# EAGLE design GasSensorCentral_v1.3 (EAGLE 7.2.0)
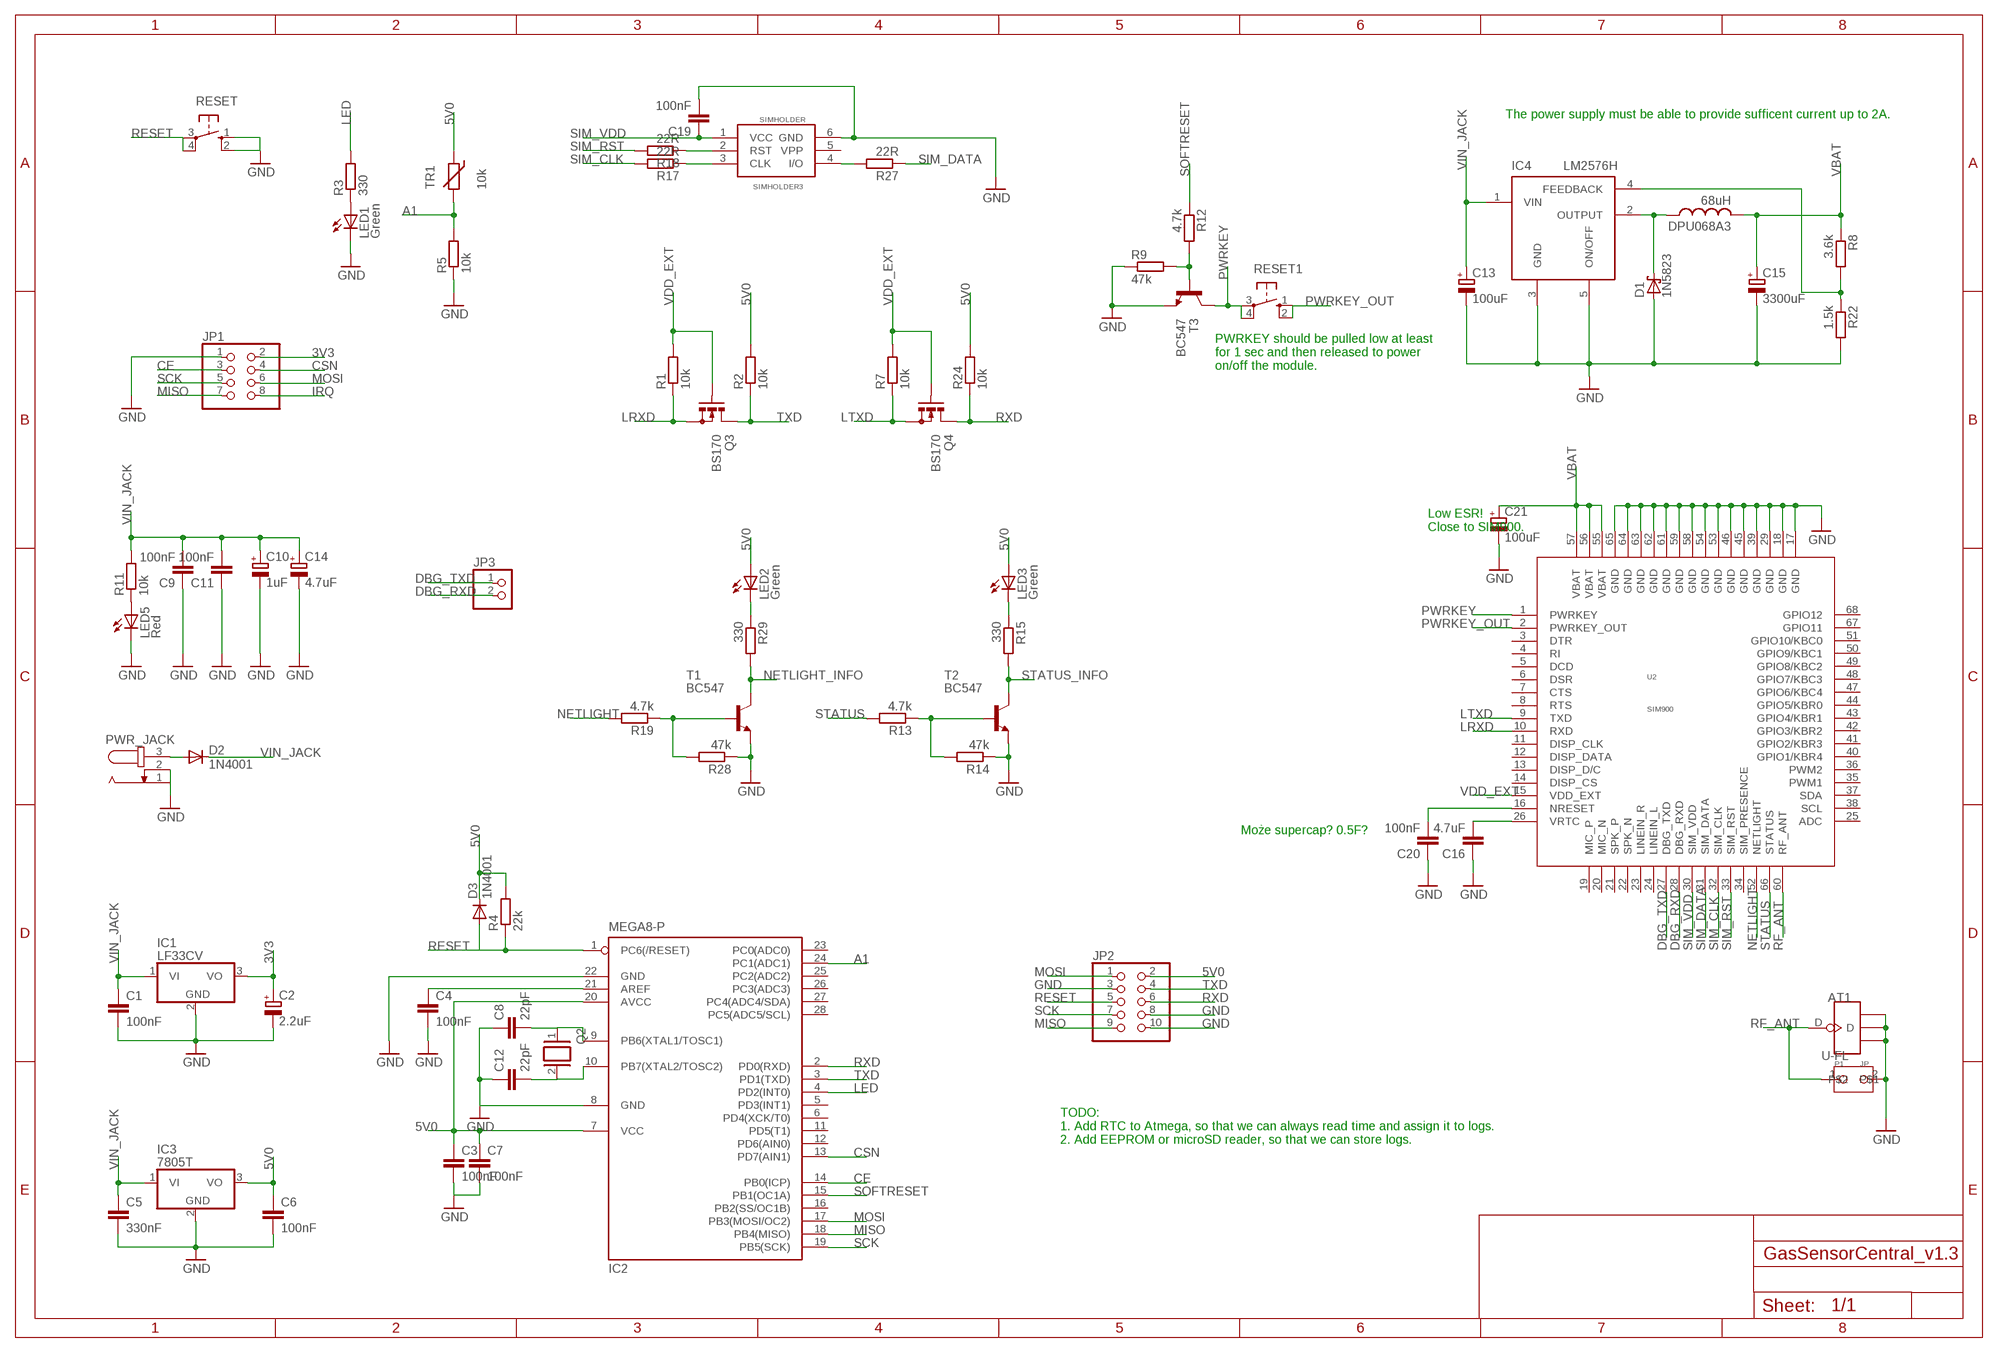
[diagram p0: schematic, sheet 1]

## Parts
AT1  U-FL  ANTENNA-U-FL  [4P-U-FL]
C1  100nF  C-EU025-025X050  [C025-025X050]
C2  2.2uF  CPOL-EUE2.5-5  [E2,5-5]
C3  100nF  C-EU025-025X050  [C025-025X050]
C4  100nF  C-EU025-025X050  [C025-025X050]
C5  330nF  C-EU025-025X050  [C025-025X050]
C6  100nF  C-EU025-025X050  [C025-025X050]
C7  100nF  C-EU025-025X050  [C025-025X050]
C8  22pF  C-EU025-025X050  [C025-025X050]
C9  100nF  C-EU025-025X050  [C025-025X050]
C10  1uF  CPOL-EUE2.5-5  [E2,5-5]
C11  100nF  C-EU025-025X050  [C025-025X050]
C12  22pF  C-EU025-025X050  [C025-025X050]
C13  100uF  CPOL-EUE2.5-5  [E2,5-5]
C14  4.7uF  CPOL-EUE2.5-5  [E2,5-5]
C15  3300uF  CPOL-EUE3.5-10  [E3,5-10]
C16  4.7uF  C-EU025-025X050  [C025-025X050]
C19  100nF  C-EU025-025X050  [C025-025X050]
C20  100nF  C-EU025-025X050  [C025-025X050]
C21  100uF  CPOL-EUE2.5-5  [E2,5-5]
D1  1N5823  1N5817-B  [DO41-7.6]
D2  1N4001  1N4004  [DO41-10]
D3  1N4001  1N4004  [DO41-10]
DPU068A3  68uH  L-USTJ3-U1  [TJ3-U1]
IC1  LF33CV  7805T  [TO220H]
IC2  MEGA8-P  [DIL28-3]
IC3  7805T  [TO220H]
IC4  LM2576H  [TO220-52]
JP1  PINHD-2X4  [2X04]
JP2  PINHD-2X5  [2X05]
JP3  PINHD-1X2  [1X02]
LED1  Green  LED3MM  [LED3MM]
LED2  Green  LED3MM  [LED3MM]
LED3  Green  LED3MM  [LED3MM]
LED5  Red  LED3MM  [LED3MM]
P1  JP  [JP]
PWR_JACK  JACK-PLUG0  [SPC4077]
Q2  XTAL/S  [QS]
Q3  BS170  [SOT54E]
Q4  BS170  [SOT54E]
R1  10k  R-EU_0207/10  [0207/10]
R2  10k  R-EU_0207/10  [0207/10]
R3  330  R-EU_0207/10  [0207/10]
R4  22k  R-EU_0207/10  [0207/10]
R5  10k  R-EU_0207/10  [0207/10]
R7  10k  R-EU_0207/10  [0207/10]
R8  3.6k  R-EU_0207/10  [0207/10]
R9  47k  R-EU_0207/10  [0207/10]
R11  10k  R-EU_0207/10  [0207/10]
R12  4.7k  R-EU_0207/10  [0207/10]
R13  4.7k  R-EU_0207/10  [0207/10]
R14  47k  R-EU_0207/10  [0207/10]
R15  330  R-EU_0207/10  [0207/10]
R17  22R  R-EU_0207/10  [0207/10]
R18  22R  R-EU_0207/10  [0207/10]
R19  4.7k  R-EU_0207/10  [0207/10]
R22  1.5k  R-EU_0207/10  [0207/10]
R24  10k  R-EU_0207/10  [0207/10]
R27  22R  R-EU_0207/10  [0207/10]
R28  47k  R-EU_0207/10  [0207/10]
R29  330  R-EU_0207/10  [0207/10]
RESET  10-XX  [B3F-10XX]
RESET1  10-XX  [B3F-10XX]
SIMHOLDER  SIMHOLDER3  [SIMHOLDER3]
T1  BC547  [TO92]
T2  BC547  [TO92]
T3  BC547  [TO92]
TR1  10k  THERMISTOR_R-2,5  [RS-2,5]
U2  SIM900  [SIM900]

## Nets
3V3: C2.+ IC1.3(VO) JP1.2
5V0: C3.1 C6.1 C7.1 D3.C IC2.7(VCC) IC2.20(AVCC) IC3.3(VO) JP2.2 LED2.A LED3.A R2.2 R4.2 R24.2 TR1.1
A1: IC2.24(PC1(ADC1)) R5.2 TR1.2
CE: IC2.14(PB0(ICP)) JP1.3
CSN: IC2.13(PD7(AIN1)) JP1.4
DBG_RXD: JP3.2 U2.28(DBG_RXD)
DBG_TXD: JP3.1 U2.27(DBG_TXD)
GND: AT1.GND1 AT1.GND2 AT1.GND3 C1.2 C2.- C3.2 C4.2 C5.2 C6.2 C7.2 C8.1 C9.1 C10.- C11.1 C12.1 C13.- C14.- C15.- C16.1 C19.2 C20.1 C21.- D1.A IC1.2(GND) IC2.8(GND) IC2.22(GND) IC3.2(GND) IC4.3(GND) IC4.5(ON/OFF) JP1.1 JP2.3 JP2.8 JP2.10 LED1.K(C) LED5.K(C) P1.2 PWR_JACK.1 PWR_JACK.2 R5.1 R9.1 R14.1 R22.2 R28.1 RESET.1(S) RESET.2(S1) SIMHOLDER.6(GND) T1.1(E) T2.1(E) T3.1(E) U2.17(GND) U2.18(GND) U2.29(GND) U2.39(GND) U2.45(GND) U2.46(GND) U2.53(GND) U2.54(GND) U2.58(GND) U2.59(GND) U2.61(GND) U2.62(GND) U2.63(GND) U2.64(GND) U2.65(GND)
IRQ: JP1.8
LED: IC2.4(PD2(INT0)) R3.2
LRXD: Q3.S R1.1 U2.10(RXD)
LTXD: Q4.S R7.1 U2.9(TXD)
MISO: IC2.18(PB4(MISO)) JP1.7 JP2.9
MOSI: IC2.17(PB3(MOSI/OC2)) JP1.6 JP2.1
N$1: C4.1 IC2.21(AREF)
N$3: IC4.4(FEEDBACK) R8.2 R22.1
N$4: D2.A PWR_JACK.3
N$5: LED1.A R3.1
N$6: R27.2 SIMHOLDER.4(I/O)
N$7: LED2.K(C) R29.1
N$9: R13.1 R14.2 T2.2(B)
N$10: LED5.A R11.1
N$11: LED3.K(C) R15.1
N$12: D1.C DPU068A3.1 IC4.2(OUTPUT)
N$13: C20.2 U2.16(NRESET)
N$14: R9.2 R12.2 T3.2(B)
N$15: R19.1 R28.2 T1.2(B)
N$17: C16.2 U2.26(VRTC)
N$24: R18.1 SIMHOLDER.2(RST)
N$25: R17.1 SIMHOLDER.3(CLK)
N$29: C8.2 IC2.9(PB6(XTAL1/TOSC1)) Q2.1
N$35: C12.2 IC2.10(PB7(XTAL2/TOSC2)) Q2.2
NETLIGHT: R19.2 U2.52(NETLIGHT)
NETLIGHT_INFO: R29.2 T1.3(C)
PWRKEY: RESET1.3(P) RESET1.4(P1) T3.3(C) U2.1(PWRKEY)
PWRKEY_OUT: RESET1.1(S) RESET1.2(S1) U2.2(PWRKEY_OUT)
RESET: D3.A IC2.1(PC6(/RESET)) JP2.5 R4.1 RESET.3(P) RESET.4(P1)
RF_ANT: AT1.D P1.1 U2.60(RF_ANT)
RXD: IC2.2(PD0(RXD)) JP2.6 Q4.D R24.1
SCK: IC2.19(PB5(SCK)) JP1.5 JP2.7
SIM_CLK: R17.2 U2.32(SIM_CLK)
SIM_DATA: R27.1 U2.31(SIM_DATA)
SIM_RST: R18.2 U2.33(SIM_RST)
SIM_VDD: C19.1 SIMHOLDER.1(VCC) U2.30(SIM_VDD)
SOFTRESET: IC2.15(PB1(OC1A)) R12.1
STATUS: R13.2 U2.66(STATUS)
STATUS_INFO: R15.2 T2.3(C)
TXD: IC2.3(PD1(TXD)) JP2.4 Q3.D R2.1
VBAT: C15.+ C21.+ DPU068A3.2 R8.1 U2.55(VBAT) U2.56(VBAT) U2.57(VBAT)
VDD_EXT: Q3.G Q4.G R1.2 R7.2 U2.15(VDD_EXT)
VIN_JACK: C1.1 C5.1 C9.2 C10.+ C11.2 C13.+ C14.+ D2.C IC1.1(VI) IC3.1(VI) IC4.1(VIN) R11.2
Unconnected: IC2.5(PD3(INT1)) IC2.6(PD4(XCK/T0)) IC2.11(PD5(T1)) IC2.12(PD6(AIN0)) IC2.16(PB2(SS/OC1B)) IC2.23(PC0(ADC0)) IC2.25(PC2(ADC2)) IC2.26(PC3(ADC3)) IC2.27(PC4(ADC4/SDA)) IC2.28(PC5(ADC5/SCL)) SIMHOLDER.5(VPP) U2.3(DTR) U2.4(RI) U2.5(DCD) U2.6(DSR) U2.7(CTS) U2.8(RTS) U2.11(DISP_CLK) U2.12(DISP_DATA) U2.13(DISP_D/C) U2.14(DISP_CS) U2.19(MIC_P) U2.20(MIC_N) U2.21(SPK_P) U2.22(SPK_N) U2.23(LINEIN_R) U2.24(LINEIN_L) U2.25(ADC) U2.34(SIM_PRESENCE) U2.35(PWM1) U2.36(PWM2) U2.37(SDA) U2.38(SCL) U2.40(GPIO1/KBR4) U2.41(GPIO2/KBR3) U2.42(GPIO3/KBR2) U2.43(GPIO4/KBR1) U2.44(GPIO5/KBR0) U2.47(GPIO6/KBC4) U2.48(GPIO7/KBC3) U2.49(GPIO8/KBC2) U2.50(GPIO9/KBC1) U2.51(GPIO10/KBC0) U2.67(GPIO11) U2.68(GPIO12)

## Notes on the sheet
- The power supply must be able to provide sufficent current up to 2A.
- PWRKEY should be pulled low at least 
  for 1 sec and then released to power 
  on/off the module.
- Low ESR!
  Close to SIM900.
- Może supercap? 0.5F?
- TODO:
  1. Add RTC to Atmega, so that we can always read time and assign it to logs.
  2. Add EEPROM or microSD reader, so that we can store logs.

## Library data of the parts
AT1 = Connector:ANTENNA-U-FL
C1 C3-C9 C11 C12 C16 C19 C20 = rcl:C-EU: CAPACITOR, European symbol
C2 C10 C13-C15 C21 = rcl:CPOL-EU: POLARIZED CAPACITOR, European symbol
D1 = diode:1N581*: 1.0A SCHOTTKY BARRIER RECTIFIER Source: http://www.diodes.com/datasheets/ds23001.pdf
D2 D3 = diode:1N4004: DIODE general purpose rectifier, 1 A
DPU068A3 = rcl:L-US: INDUCTOR, American symbol
IC1 IC3 = linear:78*: Positive VOLTAGE REGULATOR Source: http://cache.national.com/ds/LM/LM78L05.pdf http://www.fairchildsemi.com/ds/LM/LM7805.pdf
IC2 = atmel:MEGA8-P: MICROCONTROLLER 8 Kbytes FLASH, 1 kbytes SRAM, 512 bytes EEPROM, USART, 4-channel 10 bit ADC, 2-channel 8 bit ADC Pin compatible with Atmega48, ATMega88, ATMega168 Source: avr.lbr; OC_FARNELL: unknown; OC_NEWARK: unknown
IC4 = hosho:LM2576H
JP1 = pinhead:PINHD-2X4: PIN HEADER
JP2 = pinhead:PINHD-2X5: PIN HEADER
JP3 = pinhead:PINHD-1X2: PIN HEADER
LED1-LED3 LED5 = led:LED: LED OSRAM: - CHIPLED LG R971, LG N971, LY N971, LG Q971, LY Q971, LO R971, LY R971 LH N974, LH R974 LS Q976, LO Q976, LY Q976 LO Q996 - Hyper CHIPLED LW Q18S LB Q993, LB Q99A, LB R99A - SideLED LS A670, LO A670, LY A670, LG A670, LP A670 LB A673, LV A673, LT A673, LW A673 LH A674 LY A675 LS A676, LA A676, LO A676, LY A676, LW A676 LS A679, LY A679, LG A679 - Hyper Micro SIDELED® LS Y876, LA Y876, LO Y876, LY Y876 LT Y87S - SmartLED LW L88C, LW L88S LB L89C, LB L89S, LG L890 LS L89K, LO L89K, LY L89K LS L896, LA L896, LO L896, LY L896 - TOPLED LS T670, LO T670, LY T670, LG T670, LP T670 LSG T670, LSP T670, LSY T670, LOP T670, LYG T670 LG T671, LOG T671, LSG T671 LB T673, LV T673, LT T673, LW T673 LH T674 LS T676, LA T676, LO T676, LY T676, LB T676, LH T676, LSB T676, LW T676 LB T67C, LV T67C, LT T67C, LS T67K, LO T67K, LY T67K, LW E67C LS E67B, LA E67B, LO E67B, LY E67B, LB E67C, LV E67C, LT E67C LW T67C LS T679, LY T679, LG T679 LS T770, LO T770, LY T770, LG T770, LP T770 LB T773, LV T773, LT T773, LW T773 LH T774 LS E675, LA E675, LY E675, LS T675 LS T776, LA T776, LO T776, LY T776, LB T776 LHGB T686 LT T68C, LB T68C - Hyper Mini TOPLED® LB M676 - Mini TOPLED Santana® LG M470 LS M47K, LO M47K, LY M47K Source: http://www.osram.convergy.de LUXEON: - LUMILED® LXK2-PW12-R00, LXK2-PW12-S00, LXK2-PW14-U00, LXK2-PW14-V00 LXK2-PM12-R00, LXK2-PM12-S00, LXK2-PM14-U00 LXK2-PE12-Q00, LXK2-PE12-R00, LXK2-PE12-S00, LXK2-PE14-T00, LXK2-PE14-U00 LXK2-PB12-K00, LXK2-PB12-L00, LXK2-PB12-M00, LXK2-PB14-N00, LXK2-PB14-P00, LXK2-PB14-Q00 LXK2-PR12-L00, LXK2-PR12-M00, LXK2-PR14-Q00, LXK2-PR14-R00 LXK2-PD12-Q00, LXK2-PD12-R00, LXK2-PD12-S00 LXK2-PH12-R00, LXK2-PH12-S00 LXK2-PL12-P00, LXK2-PL12-Q00, LXK2-PL12-R00 Source: www.luxeon.com KINGBRIGHT: KA-3528ASYC Source: www.kingbright.com
P1 = mySeeed:JP
PWR_JACK = con-jack:JACK-PLUG: DC POWER JACK Power Jack, DC, Right Angle, Through Hole, Rated 5A at 16VDC, PC Terminals Distributor: Farnell (www.Farnell.de) Drawing: 84N1161.pdf / 84N1162.pdf Manufacturer: SPC Technology (www.spctechnology.com) Type: SPC4077 / SPC 4078; OC_FARNELL: unknown; OC_NEWARK: unknown
Q2 = special:XTAL/S: CRYSTAL
Q3 Q4 = transistor-small-signal:BS170: N-CHANNEL MOS FET
R1-R5 R7-R9 R11-R15 R17-R19 R22 R24 R27-R29 = rcl:R-EU_: RESISTOR, European symbol
RESET RESET1 = switch-omron:10-XX: OMRON SWITCH; MPN: B3F-1000; OC_FARNELL: 176432; OC_NEWARK: 36M3542
SIMHOLDER = SparkFun2:SIMHOLDER3
T1-T3 = transistor:BC547: NPN TRANSISTOR
TR1 = discrete:THERMISTOR_: Thermo Resistor
U2 = ICs_v54:SIM900

## Board
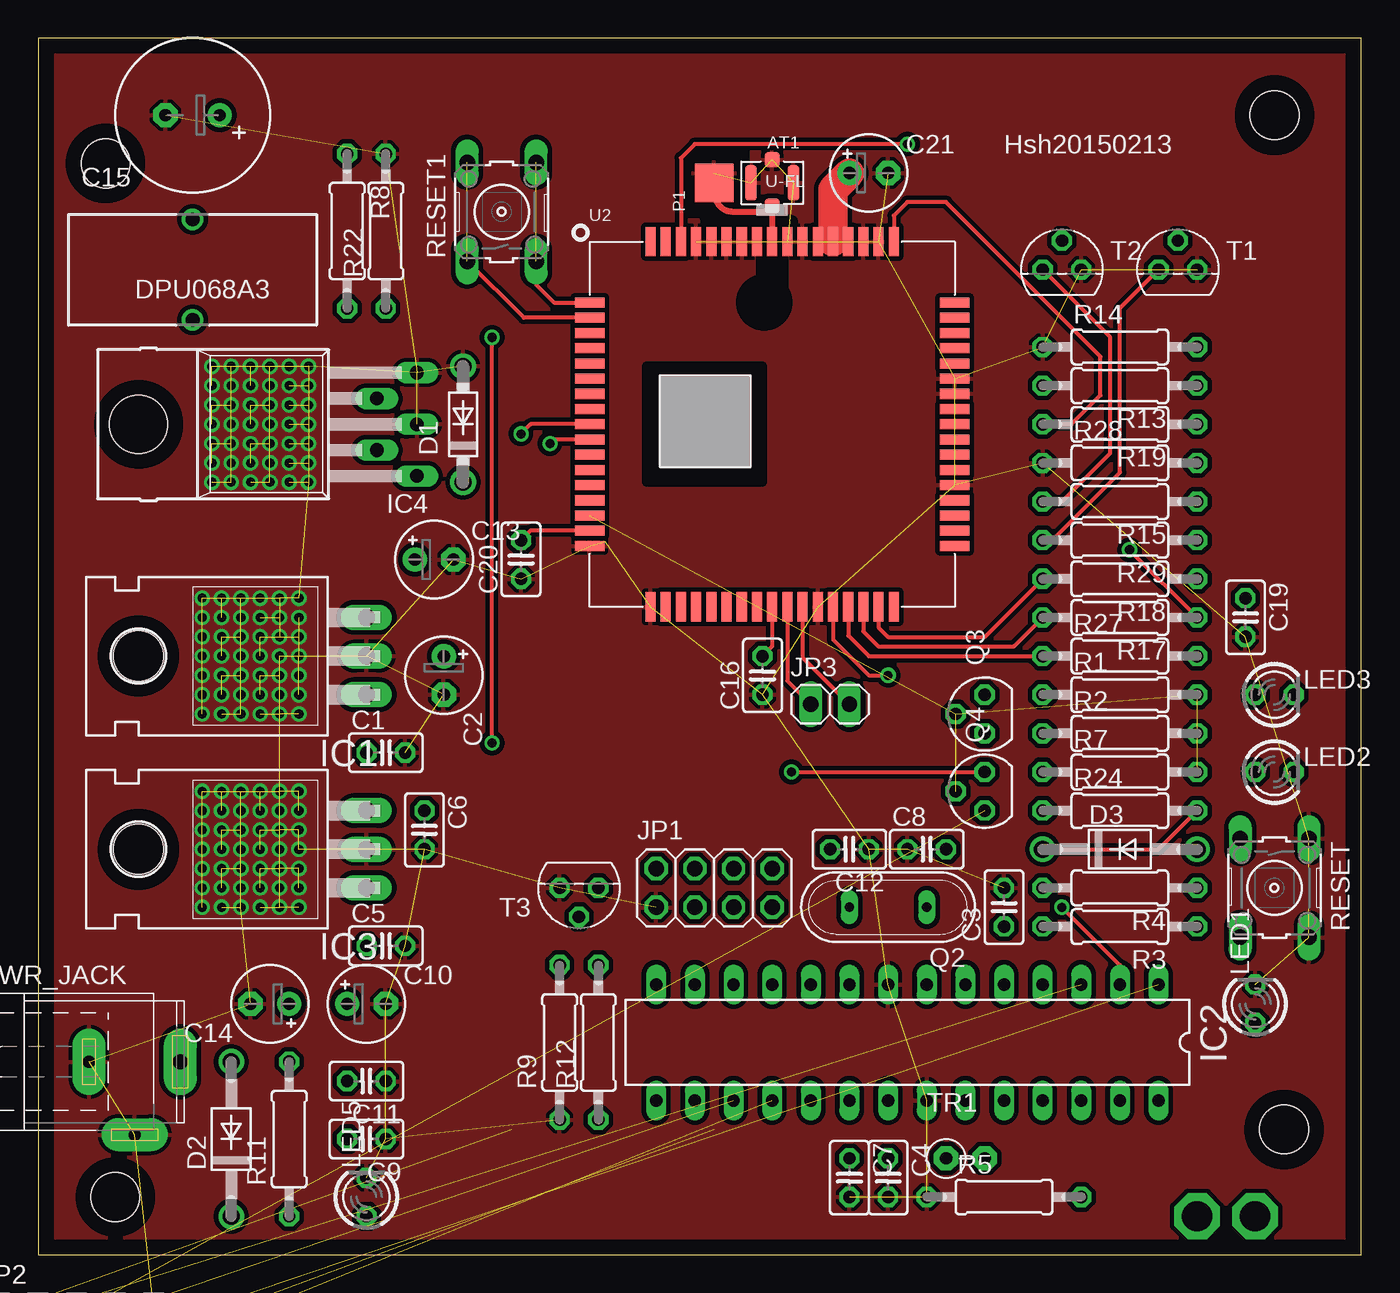
[diagram p1: board, top side]
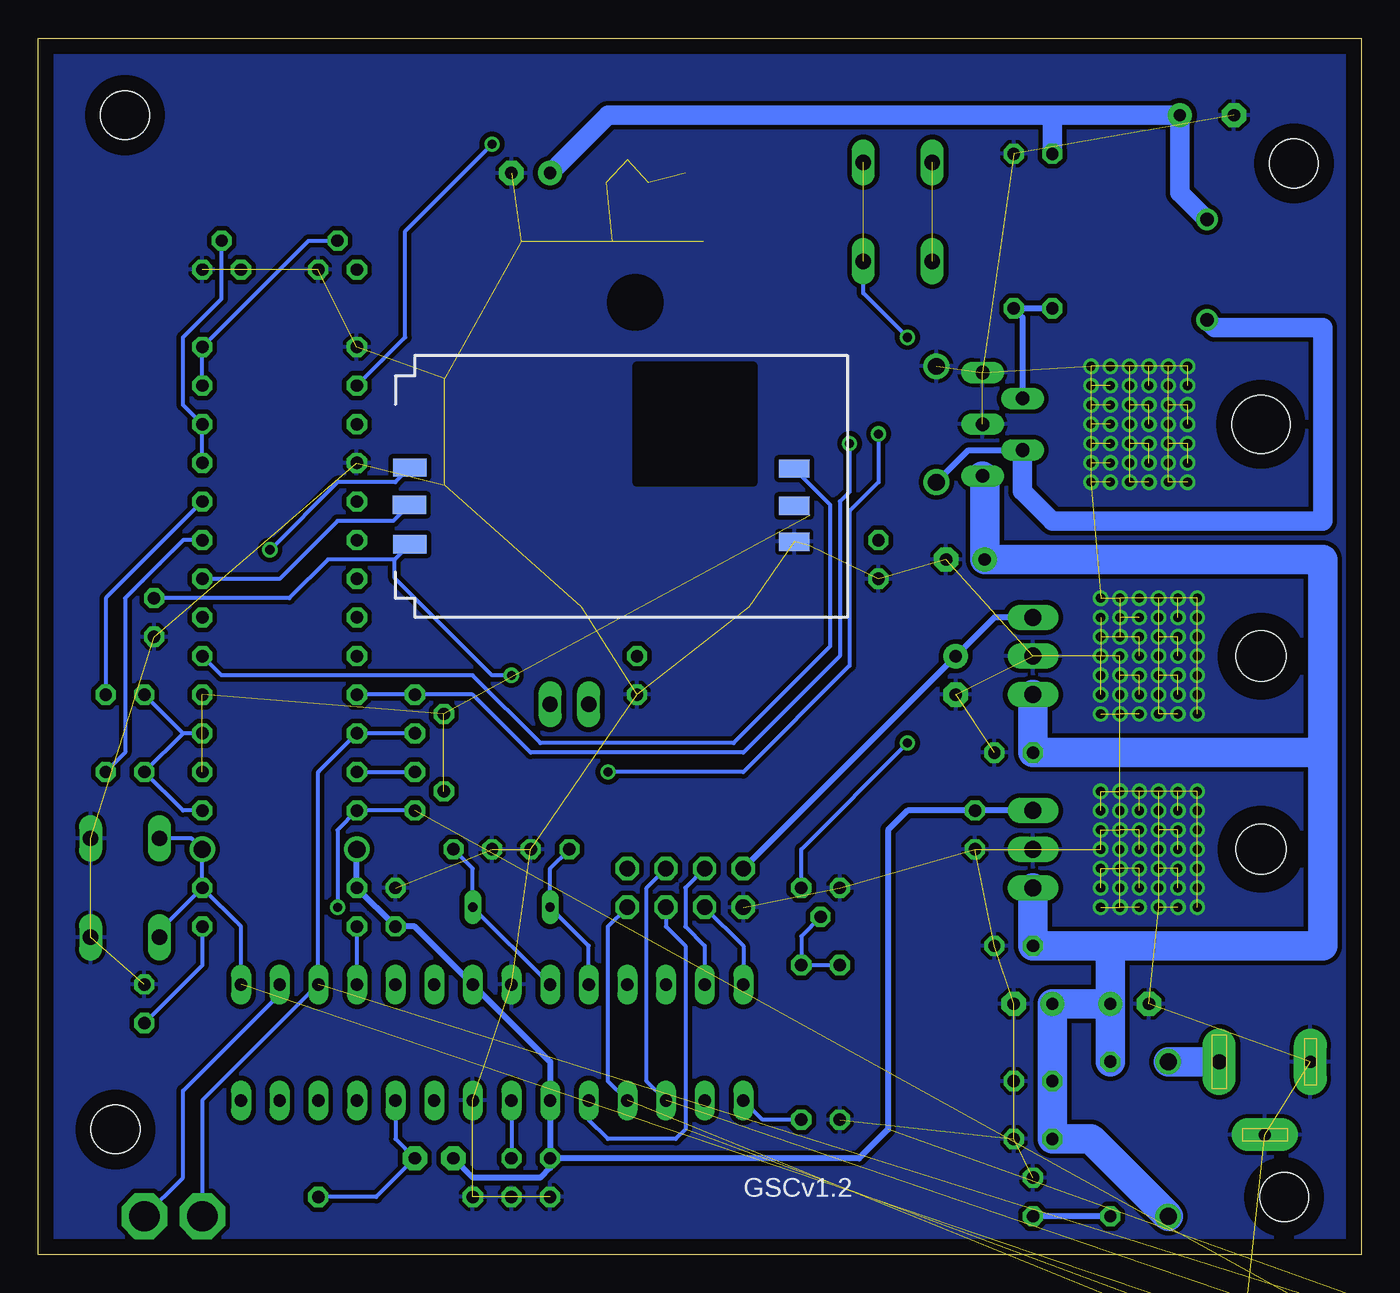
[diagram p2: board, bottom side, seen from below]

Size 87 x 80 mm. Coordinates in mm from the lower left corner, seen from the top.
Outline: 0,0 87,0 87,80 0,80 0,0
Copper layers (1*16): Top 0.035mm / dielectric 1.5mm / Bottom 0.035mm
Design rules "default": minimum track width 10mil, minimum drill 24mil, track to track 8mil, track to pad 8mil, pad to pad 8mil, via to via 8mil, smd to smd 8mil, copper to edge 40mil, drill to drill 8mil, minimum pad ring 10mil, minimum via ring 8mil, stop-mask expansion 4mil, vias tented up to drill 0mil, thermal gap 10mil
Holes 3.2 mm at 5.08,3.81 81.92,8.26 4.45,71.75 81.28,74.93
tRestrict: area 40,50.8 to 47.6,58.4; area 46.3,61.2 to 49.2,64; 11 lines
bRestrict: area 40,50.8 to 47.6,58.4; area 46.3,61.2 to 49.2,64

### Footprints (pad centres in the part's own frame; a part is rotated, then mirrored left to right if it is on the bottom)
4P-U-FL = smd 1.016 x 1.016: D -1.524,0; GND3 1.524,0 | smd 2.286 x 0.762: GND1 0,1.397; GND2 0,-1.397
C025-025X050 = drill 0.813 octagon: 1 -1.27,0; 2 1.27,0
E2,5-5 = drill 0.813 pad 1.6: + -1.27,0 | drill 0.813 pad 1.6 octagon: - 1.27,0
E3,5-10 = drill 0.813 pad 1.6: + -1.778,0 | drill 0.813 pad 1.6 octagon: - 1.778,0
DO41-7.6 = drill 1.1 pad 1.7: A 3.81,0; C -3.81,0
DO41-10 = drill 1.118: A 5.08,0; C -5.08,0
TJ3-U1 = drill 0.9: 1 -3.3,0; 2 3.3,0
TO220H = drill 1.118 long: 1 -2.54,-10.16; 2 0,-10.16; 3 2.54,-10.16 | hole 3.302: 0,4.826
DIL28-3 = drill 0.813 long: 1 -16.51,-3.81; 2 -13.97,-3.81; 3 -11.43,-3.81; 4 -8.89,-3.81; 5 -6.35,-3.81; 6 -3.81,-3.81; 7 -1.27,-3.81; 8 1.27,-3.81; 9 3.81,-3.81; 10 6.35,-3.81; 11 8.89,-3.81; 12 11.43,-3.81; 13 13.97,-3.81; 14 16.51,-3.81; 15 16.51,3.81; 16 13.97,3.81; 17 11.43,3.81; 18 8.89,3.81; 19 6.35,3.81; 20 3.81,3.81; 21 1.27,3.81; 22 -1.27,3.81; 23 -3.81,3.81; 24 -6.35,3.81; 25 -8.89,3.81; 26 -11.43,3.81; 27 -13.97,3.81; 28 -16.51,3.81
TO220-52 = drill 0.9 long: 1 -3.4,-21.1; 2 -1.7,-18.47; 3 0,-21.1; 4 1.7,-18.47; 5 3.4,-21.1 | hole 3.8: 0,-2.8
2X04 = drill 1.016 octagon: 1 -3.81,-1.27; 2 -3.81,1.27; 3 -1.27,-1.27; 4 -1.27,1.27; 5 1.27,-1.27; 6 1.27,1.27; 7 3.81,-1.27; 8 3.81,1.27
2X05 = drill 1.016 octagon: 1 -5.08,-1.27; 2 -5.08,1.27; 3 -2.54,-1.27; 4 -2.54,1.27; 5 0,-1.27; 6 0,1.27; 7 2.54,-1.27; 8 2.54,1.27; 9 5.08,-1.27; 10 5.08,1.27
1X02 = drill 1.016 long: 1 -1.27,0; 2 1.27,0
LED3MM = drill 0.813 octagon: A -1.27,0; K 1.27,0
JP = smd 1.27 x 2.54: 1 -0.635,0; 2 0.635,0
SPC4077 = drill 0.8 pad 2.184 long: 1 -3,0; 2 0,-4.8 | drill 1 pad 2.184 long: 3 3,0
QS = drill 0.61 long: 1 -2.54,0; 2 2.54,0
SOT54E = drill 0.813 octagon: D -1.27,0; G 0,1.905; S 1.27,0
0207/10 = drill 0.813 octagon: 1 -5.08,0; 2 5.08,0
B3F-10XX = drill 1.016 long: 1 -3.251,2.261; 2 3.251,2.261; 3 -3.251,-2.261; 4 3.251,-2.261
SIMHOLDER3 = smd 2.2 x 1.2: 1 0.95,4.81; 2 0.91,7.41; 3 0.95,9.86 | smd 2 x 1.2: 4 26.2,9.78; 5 26.22,7.34; 6 26.22,4.98
TO92 = drill 0.813 octagon: 1 1.27,0; 2 0,1.905; 3 -1.27,0
RS-2,5 = drill 0.813 pad 1.6 octagon: 1 -1.27,0; 2 1.27,0
SIM900 = smd 1.93 x 0.66: 1 -12,8; 2 -12,7; 3 -12,6; 4 -12,5; 5 -12,4; 6 -12,3; 7 -12,2; 8 -12,1; 9 -12,0; 10 -12,-1; 11 -12,-2; 12 -12,-3; 13 -12,-4; 14 -12,-5; 15 -12,-6; 16 -12,-7; 17 -12,-8; 35 12,-8; 36 12,-7; 37 12,-6; 38 12,-5; 39 12,-4; 40 12,-3; 41 12,-2; 42 12,-1; 43 12,0; 44 12,1; 45 12,2; 46 12,3; 47 12,4; 48 12,5; 49 12,6; 50 12,7; 51 12,8 | smd 0.66 x 1.93: 18 -8,-12; 19 -7,-12; 20 -6,-12; 21 -5,-12; 22 -4,-12; 23 -3,-12; 24 -2,-12; 25 -1,-12; 26 0,-12; 27 1,-12; 28 2,-12; 29 3,-12; 30 4,-12; 31 5,-12; 32 6,-12; 33 7,-12; 34 8,-12; 52 8,12; 53 7,12; 54 6,12; 55 5,12; 56 4,12; 57 3,12; 58 2,12; 59 1,12; 60 0,12; 61 -1,12; 62 -2,12; 63 -3,12; 64 -4,12; 65 -5,12; 66 -6,12; 67 -7,12; 68 -8,12

### Placement (x,y rotation side)
AT1  48.26,70.48 90 top
C1  22.86,33.02 0 top
C2  26.67,38.1 270 top
C3  63.5,22.86 90 top
C4  55.88,5.08 270 top
C5  22.86,20.32 0 top
C6  25.4,27.94 270 top
C7  53.34,5.08 270 top
C8  58.42,26.67 0 top
C9  21.59,7.62 180 top
C10  21.59,16.51 0 top
C11  21.59,11.43 180 top
C12  53.34,26.67 180 top
C13  26.04,45.72 0 top
C14  15.24,16.51 180 top
C15  10.16,74.93 180 top
C16  47.62,38.1 90 top
C19  79.38,41.91 270 top
C20  31.75,45.72 90 top
C21  54.61,71.12 0 top
D1  27.94,54.61 90 top
D2  12.7,7.62 90 top
D3  71.12,26.67 0 top
DPU068A3  10.16,64.77 90 top
IC1  11.43,39.37 90 top
IC2  57.15,13.97 180 top
IC3  11.43,26.67 90 top
IC4  3.81,54.61 90 top
JP1  44.45,24.13 0 top
JP2  2.54,-5.08 0 top  (outside the outline)
JP3  52.07,36.2 0 top
LED1  80.01,16.51 90 top
LED2  81.28,31.75 0 top
LED3  81.28,36.83 0 top
LED5  21.59,3.81 90 top
P1  44.45,70.48 90 top
PWR_JACK  6.35,12.7 0 top
Q2  55.88,22.86 180 top
Q3  62.23,35.56 90 top
Q4  62.23,30.48 90 top
R1  71.12,36.83 0 top
R2  71.12,34.29 0 top
R3  71.12,21.59 180 top
R4  71.12,24.13 180 top
R5  63.5,3.81 0 top
R7  71.12,31.75 0 top
R8  20.32,67.31 270 top
R9  34.29,13.97 90 top
R11  16.51,7.62 90 top
R12  36.83,13.97 90 top
R13  71.12,57.15 180 top
R14  71.12,59.69 0 top
R15  71.12,49.53 180 top
R17  71.12,41.91 180 top
R18  71.12,44.45 180 top
R19  71.12,54.61 180 top
R22  22.86,67.31 90 top
R24  71.12,29.21 0 top
R27  71.12,39.37 0 top
R28  71.12,52.07 0 top
R29  71.12,46.99 180 top
RESET  81.28,24.13 270 top
RESET1  30.48,68.58 90 top
SIMHOLDER  63.5,41.91 0 bottom
T1  74.93,64.77 0 top
T2  67.31,64.77 0 top
T3  35.56,24.13 180 top
TR1  60.96,6.35 0 top
U2  48.26,54.61 0 top

### Tracks (layer width: path | path; a pad name or v marks a point on that pad's centre or on a via)
3V3
  Bottom 0.406: IC1.3 24.13,41.91 C2.+ JP1.2
5V0  (1 unrouted)
  Top 0.254: D3.C 73.66,26.67 R24.2
  Bottom 0.254: 77.47,34.29 LED3.A | R2.2 77.47,34.29 | 77.47,34.29 LED2.A 77.47,29.21 R24.2
  Bottom 0.406: IC3.3 C6.1 29.84,29.21 31.11,27.94 31.11,8.26 33.02,6.35 C7.1 | C7.1 IC2.20 53.34,12.7 IC2.7 62.23,21.59 C3.1 R4.2 D3.C | C7.1 53.34,5.71 53.98,5.08 58.42,5.08 TR1.1
A1
  Bottom 0.254: IC2.24 63.5,7.62 TR1.2 64.77,3.81 R5.2
CE
  Bottom 0.254: JP1.3 40.64,20.32 IC2.14
CSN
  Bottom 0.254: JP1.4 44.45,24.13 44.45,21.59 43.18,20.32 IC2.13
DBG_RXD
  Top 0.254: U2.28 50.26,39.27 JP3.2
DBG_TXD
  Top 0.254: U2.27 49.26,37.73 JP3.1
GND  (via drill 0.6)  (189 unrouted)
  other vias: 10.79,22.86 10.79,24.13 10.79,25.4 10.79,26.67 10.79,27.94 10.79,29.21 10.79,30.48 12.06,30.48 12.06,29.21 12.06,27.94 12.06,26.67 12.06,25.4 12.06,24.13 12.06,22.86 13.34,22.86 13.34,24.13 13.34,25.4 13.34,26.67 13.34,27.94 13.34,29.21 13.34,30.48 14.61,30.48 14.61,29.21 14.61,27.94 14.61,26.67 14.61,25.4 14.61,24.13 14.61,22.86 15.88,22.86 15.88,24.13 15.88,25.4 15.88,26.67 15.88,27.94 15.88,29.21 15.88,30.48 17.14,30.48 17.14,29.21 17.14,27.94 17.14,26.67 17.14,25.4 17.14,24.13 17.14,22.86 10.79,35.56 10.79,36.83 10.79,38.1 10.79,39.37 10.79,40.64 10.79,41.91 10.79,43.18 12.06,43.18 12.06,41.91 12.06,40.64 12.06,39.37 12.06,38.1 12.06,36.83 12.06,35.56 13.34,35.56 13.34,36.83 13.34,38.1 13.34,39.37 13.34,40.64 13.34,41.91 13.34,43.18 14.61,43.18 14.61,41.91 14.61,40.64 14.61,39.37 14.61,38.1 14.61,36.83 14.61,35.56 15.88,35.56 15.88,36.83 15.88,38.1 15.88,39.37 15.88,40.64 15.88,41.91 15.88,43.18 17.14,43.18 17.14,41.91 17.14,40.64 17.14,39.37 17.14,38.1 17.14,36.83 17.14,35.56 11.43,50.8 11.43,52.07 11.43,53.34 11.43,54.61 11.43,55.88 11.43,57.15 11.43,58.42 12.7,58.42 12.7,57.15 12.7,55.88 12.7,54.61 12.7,53.34 12.7,52.07 12.7,50.8 13.97,50.8 13.97,52.07 13.97,53.34 13.97,54.61 13.97,55.88 13.97,57.15 13.97,58.42 15.24,58.42 15.24,57.15 15.24,55.88 15.24,54.61 15.24,53.34 15.24,52.07 15.24,50.8 16.51,50.8 16.51,52.07 16.51,53.34 16.51,54.61 16.51,55.88 16.51,57.15 16.51,58.42 17.78,58.42 17.78,57.15 17.78,55.88 17.78,54.61 17.78,53.34 17.78,52.07 17.78,50.8
  pour Bottom (isolate 0.305): 0,80.01 87,80.01 87,0 0,0
  pour Top (isolate 0.305): 0,80.01 87,80.01 87,0 0,0
LED
  Bottom 0.254: R3.2 IC2.4
LRXD  (via drill 0.6)
  Top 0.254: U2.10 33.92,53.61 v33.66,53.34
  Bottom 0.254: v33.66,53.34 33.66,50.16 34.29,49.53 34.29,39.37 40.64,33.02 54.61,33.02 58.42,36.83 Q3.S R1.1
LTXD  (via drill 0.6)
  Top 0.254: U2.9 32.38,54.61 v31.75,53.98 | v49.53,31.75 Q4.S
  Bottom 0.254: R7.1 Q4.S | v31.75,53.98 31.75,50.8 33.66,48.9 33.66,38.73 40.64,31.75 v49.53,31.75
MISO  (1 unrouted)
  Bottom 0.254: IC2.18 49.53,11.43 49.53,21.59 JP1.7
MOSI  (1 unrouted)
  Bottom 0.254: IC2.17 46.99,11.43 46.99,24.13 JP1.6
N$1
  Bottom 0.254: IC2.21 C4.1
N$3
  Bottom 0.406: R8.2 R22.1 22.28,61.65 IC4.4
N$4
  Bottom 1.93: PWR_JACK.3 D2.A
N$5
  Bottom 0.254: R3.1 76.2,19.05 LED1.A
N$6
  Bottom 0.254: SIMHOLDER.4 34.92,49.31 34.92,40.01 41.27,33.66 53.98,33.66 58.42,38.1 74.93,38.1 R27.2
N$7
  Bottom 0.254: R29.1 77.47,46.99 81.28,43.18 81.28,33.02 LED2.K
N$9
  Bottom 0.254: R13.1 R14.2 69.22,66.67 T2.2
N$10
  Bottom 0.406: R11.1 LED5.A
N$11
  Bottom 0.254: R15.1 82.55,43.18 LED3.K
N$12
  Bottom 0.406: D1.C 25.83,52.91 IC4.2
  Bottom 1.27: IC4.2 22.28,50.22 20.32,48.26 2.54,48.26 2.54,60.96 9.65,60.96 DPU068A3.1
N$13
  Top 0.254: U2.16 32.37,47.61 C20.2
N$14
  Bottom 0.254: T3.2 36.83,20.95 R12.2 R9.2
N$15
  Bottom 0.254: R28.2 R19.1 77.47,55.88 77.47,60.33 74.93,62.87 T1.2
N$17
  Top 0.254: U2.26 48.26,40.01 C16.2
N$24
  Bottom 0.254: SIMHOLDER.2 63.65,48.26 67.31,48.26 71.12,44.45 R18.1
N$25  (via drill 0.6)
  Top 0.254: v71.75,46.35 R17.1
  Bottom 0.254: SIMHOLDER.3 63.52,50.8 67.31,50.8 v71.75,46.35
N$29
  Bottom 0.254: IC2.9 Q2.1 58.42,25.4 C8.2
N$35
  Bottom 0.254: IC2.10 50.8,20.32 Q2.2 53.34,25.4 C12.2
NETLIGHT
  Top 0.254: U2.52 56.26,68.33 57.15,69.22 59.69,69.22 69.85,59.05 69.85,56.52 67.94,54.61 R19.2
NETLIGHT_INFO
  Top 0.254: R29.2 66.67,46.99 71.12,51.44 71.12,62.23 T1.3
PWRKEY  (via drill 0.6)  (1 unrouted)
  Top 0.254: RESET1.3 32.74,63.78 33.91,62.61 U2.1 | v29.84,33.66 v29.84,60.33
  Bottom 0.254: T3.3 36.83,26.67 v29.84,33.66 | v29.84,60.33 32.74,63.22 RESET1.3
PWRKEY_OUT  (1 unrouted)
  Top 0.254: U2.2 31.94,61.61 RESET1.1
RESET  (1 unrouted)
  Bottom 0.254: R4.1 79.02,21.31 RESET.4 | R4.1 D3.A 76.91,27.38 RESET.3 | IC2.1 73.66,21.59 R4.1
RF_ANT
  Top 0.406: AT1.D 48.26,68.58 | 48.26,68.58 U2.60 | P1.1 arc90 45.72,68.58 48.26,68.58
RXD  (via drill 0.6, 2)  (1 unrouted)
  Top 0.254: IC2.2 71.12,19.05 v67.31,22.86
  Bottom 0.254: Q4.D R24.1 67.31,27.94 v67.31,22.86 | v80.01,2.54 77.47,5.08 77.47,10.79 71.12,17.14 IC2.2
SCK  (1 unrouted)
  Bottom 0.254: JP1.5 45.72,21.59 44.45,20.32 44.45,8.26 45.09,7.62 49.53,7.62 50.8,8.89 IC2.19
SIM_CLK
  Top 0.254: U2.32 54.26,40.99 55.24,40.01 64.14,40.01 R17.2
SIM_DATA
  Top 0.254: U2.31 53.26,40.72 54.61,39.37 R27.1
SIM_RST
  Top 0.254: U2.33 55.26,41.26 55.88,40.64 62.23,40.64 R18.2
SIM_VDD  (via drill 0.6)
  Top 0.254: U2.30 52.26,40.45 54.61,38.1 v55.88,38.1
  Bottom 0.254: SIMHOLDER.1 63.55,45.72 | 63.55,45.72 67.94,45.72 70.48,43.18 C19.1 | v55.88,38.1 57.15,38.1 63.55,44.5 63.55,45.72
SOFTRESET
  Bottom 0.254: R12.1 39.37,8.89 IC2.15
STATUS  (via drill 0.6)
  Top 0.254: U2.66 42.26,72.11 43.18,73.03 v57.15,73.03
  Bottom 0.254: R13.2 62.87,60.33 62.87,67.31 v57.15,73.03
STATUS_INFO
  Top 0.254: R15.2 67.31,49.53 70.48,52.7 70.48,60.33 T2.3
TXD  (via drill 2)  (1 unrouted)
  Bottom 0.254: Q3.D R2.1 68.58,31.75 IC2.3 76.2,10.16 v76.2,2.54
VBAT
  Top 0.406: U2.55 U2.56 U2.57
  Top 1.93: C21.+ 52.26,70.04 U2.56
  Bottom 1.27: C21.+ 49.53,74.93 21.59,74.93 20.32,74.93 | R8.1 20.32,74.93 | DPU068A3.2 11.94,69.85 C15.+ 20.32,74.93
VDD_EXT  (4 unrouted)
VIN_JACK
  Bottom 1.93: D2.C 17.78,7.62 C9.2 C11.2 C10.+ C14.+ | C14.+ R11.2 | IC3.1 C5.1 | C5.1 2.54,20.32 2.54,33.02 | 2.54,33.02 C1.1 IC1.1 | C5.1 16.51,20.32 C14.+ | 2.54,33.02 2.54,45.72 C13.+ 24.77,51.06 IC4.1

### Text on the board
tPlace: Hsh20150213
bPlace: GSCv1.2